# Altium schematic sheet Power_Supplies.SchDoc
size B
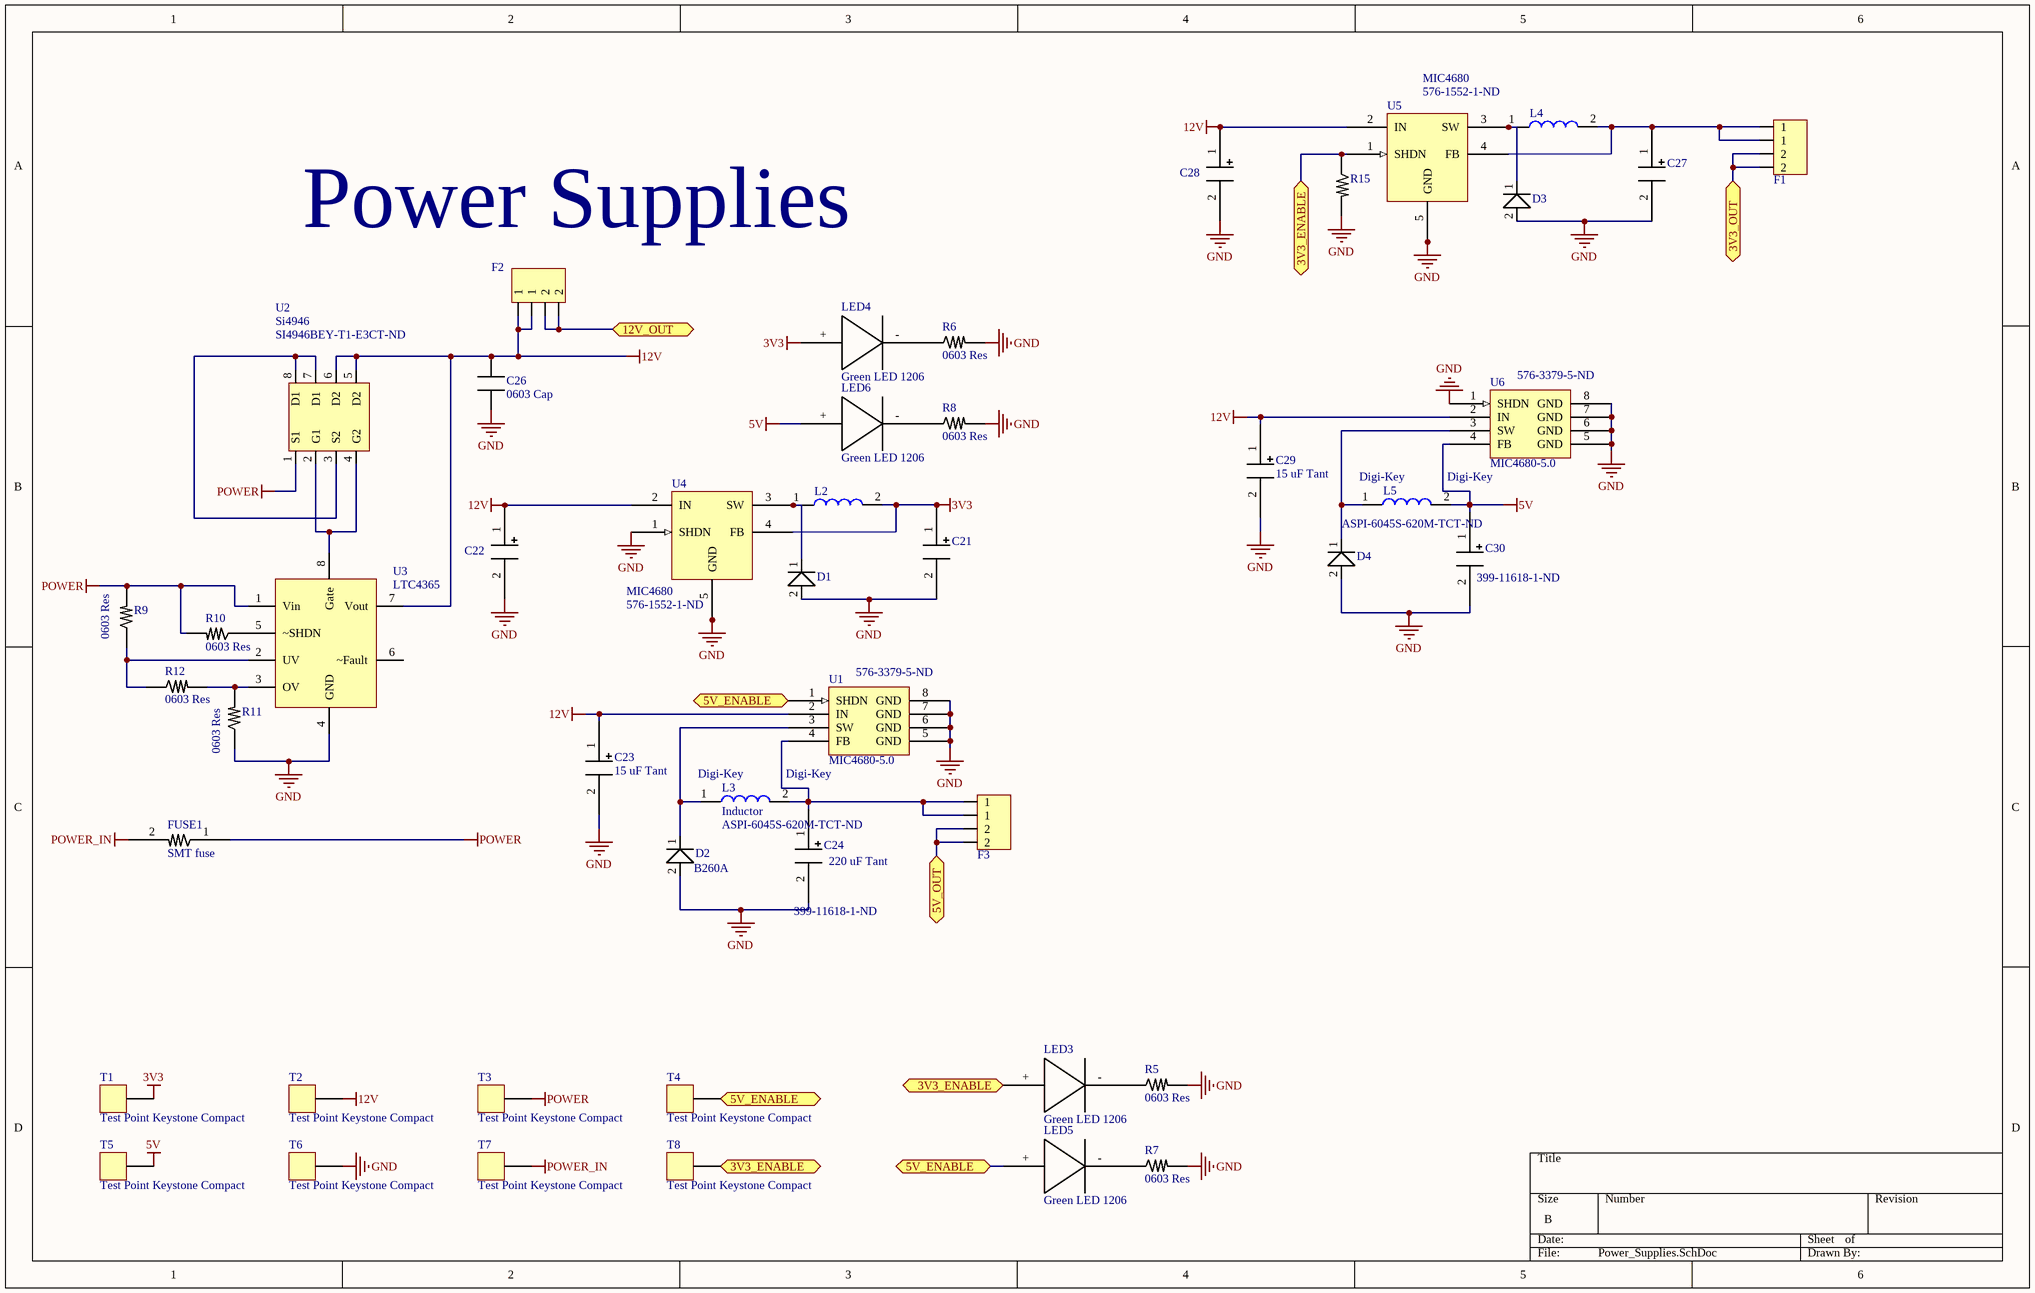
[diagram p0: Power_Supplies.SchDoc]

## Parts
C21  220 uF Tantalum Capacitor  [2312 Surface Mount (POLAR)]  (value not drawn)
C22  15 uF Tantalum Capacitor  [1206 (POLAR)]  (value not drawn)
C23  15 uF Tant  [1206 (POLAR)]
C24  220 uF Tant  Supplier Part Number 1: 399-11618-1-ND  [2312 Surface Mount (POLAR)]
C26  0603 Cap  [0603/1608 SMD Resistor]
C27  220 uF Tantalum Capacitor  [2312 Surface Mount (POLAR)]  (value not drawn)
C28  15 uF Tantalum Capacitor  [1206 (POLAR)]  (value not drawn)
C29  15 uF Tant  [1206 (POLAR)]
C30  Supplier Part Number 1: 399-11618-1-ND  [2312 Surface Mount (POLAR)]  (hidden comment: 220 uF Tant)
D1  B260A Flyback Diode  [DO-214AC]  (value not drawn)
D2  B260A  [DO-214AC]
D3  B260A Flyback Diode  [DO-214AC]  (value not drawn)
D4  B260A  [DO-214AC]  (value not drawn)
F1  Keystone Fuseholder  [Keystone Fuseholder 3568]  (value not drawn)
F2  Keystone Fuseholder  [Keystone Fuseholder 3568]  (value not drawn)
F3  Keystone Fuseholder  [Keystone Fuseholder 3568]  (value not drawn)
FUSE1  SMT fuse  [1206]
L2  ASPI-6045S  [ASPI-6045]  (value not drawn)
L3  Inductor  Supplier 1: Digi-Key  Supplier Part Number 1: ASPI-6045S-620M-TCT-ND  [ASPI-6045]
L4  ASPI-6045S  [ASPI-6045]  (value not drawn)
L5  Supplier 1: Digi-Key  Supplier Part Number 1: ASPI-6045S-620M-TCT-ND  [ASPI-6045]  (hidden comment: Inductor)
LED3  Green LED 1206  [Panel_Mount_LED]
LED4  Green LED 1206  [Panel_Mount_LED]
LED5  Green LED 1206  [Cathode Mark 1206 led footprint]
LED6  Green LED 1206  [Cathode Mark 1206 led footprint]
R5  0603 Res  [0603/1608 SMD Resistor]
R6  0603 Res  [0603/1608 SMD Resistor]
R7  0603 Res  [0603/1608 SMD Resistor]
R8  0603 Res  [0603/1608 SMD Resistor]
R9  0603 Res  [0603/1608 SMD Resistor]
R10  0603 Res  [0603/1608 SMD Resistor]
R11  0603 Res  [0603/1608 SMD Resistor]
R12  0603 Res  [0603/1608 SMD Resistor]
R15  0603 Res  [0603/1608 SMD Resistor]  (value not drawn)
T1  Test Point Keystone Compact  [Keystone Test Point Compact]
T2  Test Point Keystone Compact  [Keystone Test Point Compact]
T3  Test Point Keystone Compact  [Keystone Test Point Compact]
T4  Test Point Keystone Compact  [Keystone Test Point Compact]
T5  Test Point Keystone Compact  [Keystone Test Point Compact]
T6  Test Point Keystone Compact  [Keystone Test Point Compact]
T7  Test Point Keystone Compact  [Keystone Test Point Compact]
T8  Test Point Keystone Compact  [Keystone Test Point Compact]
U1  MIC4680-5.0  Supplier 1: Digi-Key  Supplier Part Number 1: 576-3379-5-ND  [SOIC8]
U2  Si4946  Supplier Part Number 1: SI4946BEY-T1-E3CT-ND  [S0-8]
U3  LTC4365  [TS8]
U4  MIC4680  Supplier Part Number 1: 576-1552-1-ND  [TJA1040]
U5  MIC4680  Supplier Part Number 1: 576-1552-1-ND  [TJA1040]
U6  MIC4680-5.0  Supplier 1: Digi-Key  Supplier Part Number 1: 576-3379-5-ND  [SOIC8]

## Ports
3V3_ENABLE, 3V3_ENABLE (bidir), 3V3_OUT, 5V_ENABLE (bidir), 5V_OUT, 12V_OUT

## Nets
3V3: C21.1 L2.2 LED4.+ T1.1 U4.4(FB)
5V: C30.1 L5.2 LED6.+ T5.1 U6.4(FB)
12V: C22.1 C23.1 C26.2 C28.1 C29.1 F2.1 F2.2(1) T2.1 U1.2(IN) U2.5(D2) U2.6(D2) U3.7(Vout) U4.2(IN) U5.2(IN) U6.2(IN)
GND: C21.2 C22.2 C23.2 C24.2 C26.1 C27.2 C28.2 C29.2 C30.2 D1.2 D2.2 D3.2 D4.2 R5.2 R6.2 R7.2 R8.2 R11.1 R15.2 T6.1 U1.5(GND) U1.6(GND) U1.7(GND) U1.8(GND) U3.4(GND) U4.1(SHDN) U4.5(GND) U4.6 U4.7 U4.8 U5.5(GND) U5.6 U5.7 U5.8 U6.1(SHDN) U6.5(GND) U6.6(GND) U6.7(GND) U6.8(GND)
POWER: FUSE1.1 R9.2 R10.2 T3.1 U2.1(S1) U3.1(Vin)
POWER_IN: FUSE1.2 T7.1
3V3_ENABLE: LED3.+ R15.1 T8.1 U5.1(SHDN) ; port 3V3_ENABLE
3V3_OUT: F1.3(2) F1.4(2) ; port 3V3_OUT
5V_ENABLE: LED5.+ T4.1 U1.1(SHDN) ; port 5V_ENABLE
5V_OUT: F3.3(2) F3.4(2) ; port 5V_OUT
12V_OUT: F2.3(2) F2.4(2) ; port 12V_OUT
NetC24_1: C24.1 F3.1 F3.2(1) L3.2 U1.4(FB)
NetC27_1: C27.1 F1.1 F1.2(1) L4.2 U5.4(FB)
NetD1_1: D1.1 L2.1 U4.3(SW)
NetD2_1: D2.1 L3.1 U1.3(SW)
NetD3_1: D3.1 L4.1 U5.3(SW)
NetD4_1: D4.1 L5.1 U6.3(SW)
NetLED3_-: LED3.- R5.1
NetLED4_-: LED4.- R6.1
NetLED5_-: LED5.- R7.1
NetLED6_-: LED6.- R8.1
NetR9_1: R9.1 R12.1 U3.2(UV)
NetR10_1: R10.1 U3.5(~SHDN)
NetR11_2: R11.2 R12.2 U3.3(OV)
NetU2_2: U2.2(G1) U2.4(G2) U3.8(Gate)
NetU2_3: U2.3(S2) U2.7(D1) U2.8(D1)

Not connected (* = marked no-connect by the designer): U3 6(~Fault)

## Notes on the sheet
- Power Supplies

## Library data of the parts
C21 C24 C27 C30 = 220 uF Tantalum Capacitor: 2312 Surface Mount Capacitor
  C24 C30: Supplier 1: Digi-Key
C22 C23 C28 C29 = 15 uF Tantalum Capacitor: 1206 Surface Mount Capacitor
C26 = 0603 Cap: 100 uF electrolytic cap
D2 D4 = B260A Flyback Diode
FUSE1 = 0 Resistor Surface mount 1206: 0 ohm surface mount resistor.; ComponentLink1URL: http://industrial.panasonic.com/www-cgi/jvcr13pz.cgi?E+PZ+3+AOA0001+ERJ8GEYJ103V+7+WW; ComponentLink1Description: Datasheet for 10k Resistor
L2 L4 = ASPI-6045S: 68 uH 1.2A surface mount inductor
LED3-LED6 = 1206 Green LED: Green surface mount LED
R9 = 0603 Res: 6.04 MOhm Res
R10 = 0603 Res: 100 kOhm SMD Res
R11 = 0603 Res: 210 kOhm Res
R15 = 0603 Res: Pull Down, 1kOhm
U1 U6 = MIC4680-5.0: 5V Fixed Switching Regulator 1A
U4 U5 = MIC4680: 3.3V Fixed Switching Regulator 1A; Supplier 1: Digi-Key
F1-F3 = Keystone Fuseholder: Supplier 1: Digi-Key; Supplier Part Number 1: 36-3568-ND
L3 L5 = Inductor: Supplier 2: Digi-Key; Supplier 3: Digi-Key; Supplier Part Number 2: 308-1571-1-ND; Supplier Part Number 3: SRP7030-4R7FMCT-ND
T1-T8 = Test Point Keystone Compact: Supplier 1: Digi-Key; Supplier Part Number 1: 36-5006-ND
U2 = Si4946: Supplier 1: Digi-Key